# EAGLE design SureDSP Breakout (EAGLE 7.6.0)
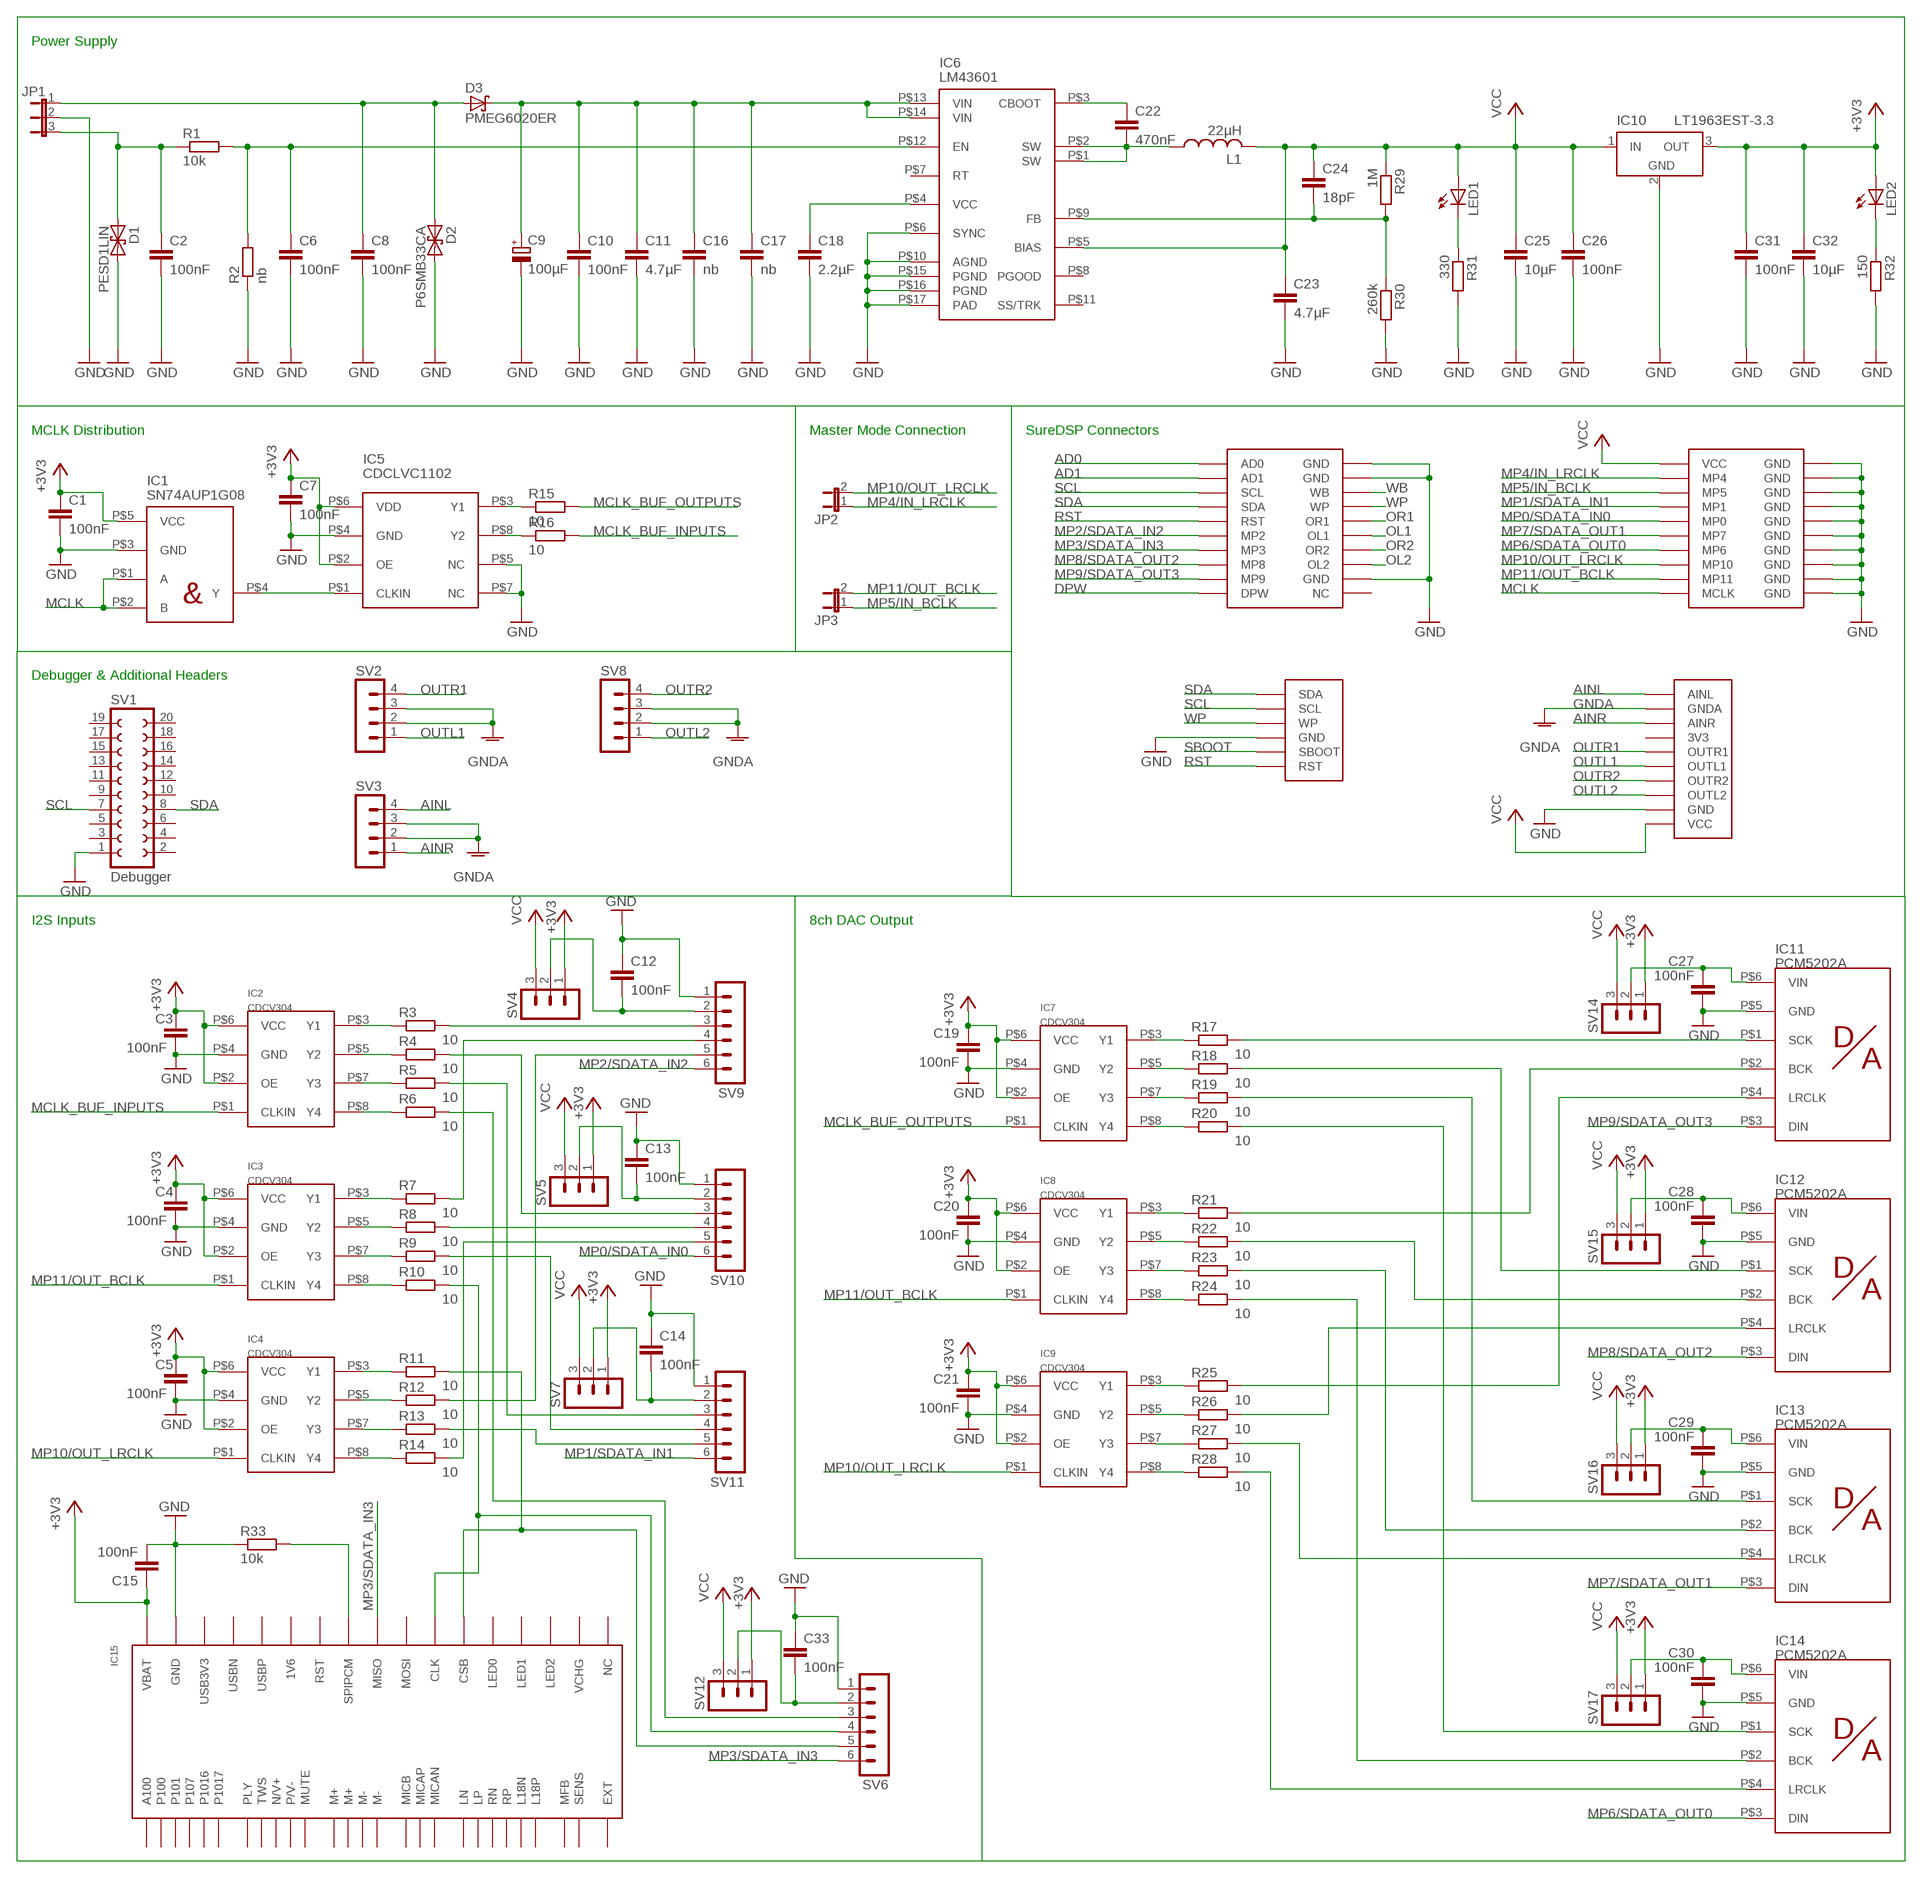
[diagram p0: schematic, sheet 1]

## Parts
C1  100nF  C-EUC0805K  [C0805K]
C2  100nF  C-EUC1210K  [C1210K]
C3  100nF  C-EUC0805K  [C0805K]
C4  100nF  C-EUC0805K  [C0805K]
C5  100nF  C-EUC0805K  [C0805K]
C6  100nF  C-EUC1210K  [C1210K]
C7  100nF  C-EUC0805K  [C0805K]
C8  100nF  C-EUC1210K  [C1210K]
C9  100µF  CPOL-EU150CLZ-0810  [150CLZ-0810]
C10  100nF  C-EUC1210K  [C1210K]
C11  4.7µF  C-EUC1210K  [C1210K]
C12  100nF  C-EUC0805K  [C0805K]
C13  100nF  C-EUC0805K  [C0805K]
C14  100nF  C-EUC0805K  [C0805K]
C15  100nF  C-EUC0805K  [C0805K]
C16  nb  C-EUC1210K  [C1210K]
C17  nb  C-EUC1210K  [C1210K]
C18  2.2µF  C-EUC0805K  [C0805K]
C19  100nF  C-EUC0805K  [C0805K]
C20  100nF  C-EUC0805K  [C0805K]
C21  100nF  C-EUC0805K  [C0805K]
C22  470nF  C-EUC0805K  [C0805K]
C23  4.7µF  C-EUC0805K  [C0805K]
C24  18pF  C-EUC0805K  [C0805K]
C25  10µF  C-EUC1210K  [C1210K]
C26  100nF  C-EUC0805K  [C0805K]
C27  100nF  C-EUC0805K  [C0805K]
C28  100nF  C-EUC0805K  [C0805K]
C29  100nF  C-EUC0805K  [C0805K]
C30  100nF  C-EUC0805K  [C0805K]
C31  100nF  C-EUC0805K  [C0805K]
C32  10µF  C-EUC1210K  [C1210K]
C33  100nF  C-EUC0805K  [C0805K]
D1  PESD1LIN  [PESD1LIN]
D2  P6SMB33CA  [P6SMB]
D3  PMEG6020ER  [PMEG6020ER]
IC1  SN74AUP1G08  [SN74AUP1G08]
IC2  CDCV304  [CDCV304]
IC3  CDCV304  [CDCV304]
IC4  CDCV304  [CDCV304]
IC5  CDCLVC1102  [CDCLVC1102]
IC6  LM43601  [LM43601]
IC7  CDCV304  [CDCV304]
IC8  CDCV304  [CDCV304]
IC9  CDCV304  [CDCV304]
IC10  LT1963EST-3.3  [SOT223]
IC11  PCM5202A  [PCM5202A]
IC12  PCM5202A  [PCM5202A]
IC13  PCM5202A  [PCM5202A]
IC14  PCM5202A  [PCM5202A]
IC15  CSRA64215  [CSRA64215]
IC16  SUREDSP  [SUREDSP]
JP1  JP2E  [JP2]
JP2  JP1E  [JP1]
JP3  JP1E  [JP1]
L1  22µH  L-USL5650M  [L5650M]
LED1  LEDSML0805  [SML0805]
LED2  LEDSML0805  [SML0805]
R1  10k  R-EU_R2012  [R2012]
R2  nb  R-EU_R2012  [R2012]
R3  10  R-EU_R2012  [R2012]
R4  10  R-EU_R2012  [R2012]
R5  10  R-EU_R2012  [R2012]
R6  10  R-EU_R2012  [R2012]
R7  10  R-EU_R2012  [R2012]
R8  10  R-EU_R2012  [R2012]
R9  10  R-EU_R2012  [R2012]
R10  10  R-EU_R2012  [R2012]
R11  10  R-EU_R2012  [R2012]
R12  10  R-EU_R2012  [R2012]
R13  10  R-EU_R2012  [R2012]
R14  10  R-EU_R2012  [R2012]
R15  10  R-EU_R2012  [R2012]
R16  10  R-EU_R2012  [R2012]
R17  10  R-EU_R2012  [R2012]
R18  10  R-EU_R2012  [R2012]
R19  10  R-EU_R2012  [R2012]
R20  10  R-EU_R2012  [R2012]
R21  10  R-EU_R2012  [R2012]
R22  10  R-EU_R2012  [R2012]
R23  10  R-EU_R2012  [R2012]
R24  10  R-EU_R2012  [R2012]
R25  10  R-EU_R2012  [R2012]
R26  10  R-EU_R2012  [R2012]
R27  10  R-EU_R2012  [R2012]
R28  10  R-EU_R2012  [R2012]
R29  1M  R-EU_R2012  [R2012]
R30  260k  R-EU_R2012  [R2012]
R31  330  R-EU_R2012  [R2012]
R32  150  R-EU_R2012  [R2012]
R33  10k  R-EU_R2012  [R2012]
SV1  Debugger  FE10-2  [FE10-2]
SV2  MA04-1  [MA04-1]
SV3  MA04-1  [MA04-1]
SV4  MA03-1  [MA03-1]
SV5  MA03-1  [MA03-1]
SV6  MA06-1  [MA06-1]
SV7  MA03-1  [MA03-1]
SV8  MA04-1  [MA04-1]
SV9  MA06-1  [MA06-1]
SV10  MA06-1  [MA06-1]
SV11  MA06-1  [MA06-1]
SV12  MA03-1  [MA03-1]
SV14  MA03-1  [MA03-1]
SV15  MA03-1  [MA03-1]
SV16  MA03-1  [MA03-1]
SV17  MA03-1  [MA03-1]

## Nets
+3V3: C1.1 C3.1 C4.1 C5.1 C7.1 C15.1 C19.1 C20.1 C21.1 C31.1 C32.1 IC1.P$5(VCC) IC2.P$2(OE) IC2.P$6(VCC) IC3.P$2(OE) IC3.P$6(VCC) IC4.P$2(OE) IC4.P$6(VCC) IC5.P$2(OE) IC5.P$6(VDD) IC7.P$2(OE) IC7.P$6(VCC) IC8.P$2(OE) IC8.P$6(VCC) IC9.P$2(OE) IC9.P$6(VCC) IC10.3(OUT) IC15.P$5(VBAT) LED2.A SV4.1 SV5.1 SV7.1 SV12.1 SV14.1 SV15.1 SV16.1 SV17.1
AD0: IC16.AD0
AD1: IC16.AD1
AINL: IC16.AINL SV3.4
AINR: IC16.AINR SV3.1
DPW: IC16.DPW
GND: C1.2 C2.2 C3.2 C4.2 C5.2 C6.2 C7.2 C8.2 C9.- C10.2 C11.2 C12.1 C13.1 C14.1 C15.2 C16.2 C17.2 C18.2 C19.2 C20.2 C21.2 C23.2 C25.2 C26.2 C27.2 C28.2 C29.2 C30.2 C31.2 C32.2 C33.1 D1.P$2 D2.P$2 IC1.P$3(GND) IC2.P$4(GND) IC3.P$4(GND) IC4.P$4(GND) IC5.P$4(GND) IC5.P$5(NC) IC5.P$7(NC) IC6.P$6(SYNC) IC6.P$10(AGND) IC6.P$15(PGND) IC6.P$16(PGND) IC6.P$17(PAD) IC7.P$4(GND) IC8.P$4(GND) IC9.P$4(GND) IC10.2(GND) IC11.P$5(GND) IC12.P$5(GND) IC13.P$5(GND) IC14.P$5(GND) IC15.P$6(GND) IC16.GND6ER(GND) IC16.GND10ER(GND) IC16.GND20ER1(GND) IC16.GND20ER2(GND) IC16.GND20ER(GND) IC16.P$2(GND) IC16.P$3(GND) IC16.P$6(GND) IC16.P$8(GND) IC16.P$10(GND) IC16.P$12(GND) IC16.P$14(GND) IC16.P$16(GND) IC16.P$18(GND) IC16.P$55(GND) JP1.2 R2.1 R30.2 R31.2 R32.2 R33.1 SV1.1 SV6.1 SV9.1 SV10.1 SV11.1
GNDA: IC16.AGND(GNDA) SV2.2 SV2.3 SV3.2 SV3.3 SV8.2 SV8.3
MCLK: IC1.P$1(A) IC1.P$2(B) IC16.MCLK
MCLK_BUF_INPUTS: IC2.P$1(CLKIN) R16.2
MCLK_BUF_OUTPUTS: IC7.P$1(CLKIN) R15.2
MP0/SDATA_IN0: IC16.MP0 SV10.6
MP1/SDATA_IN1: IC16.MP1 SV11.6
MP2/SDATA_IN2: IC16.MP2 SV9.6
MP3/SDATA_IN3: IC15.P$7(MISO) IC16.MP3 SV6.6
MP4/IN_LRCLK: IC16.MP4 JP2.1
MP5/IN_BCLK: IC16.MP5 JP3.1
MP6/SDATA_OUT0: IC14.P$3(DIN) IC16.MP6
MP7/SDATA_OUT1: IC13.P$3(DIN) IC16.MP7
MP8/SDATA_OUT2: IC12.P$3(DIN) IC16.MP8
MP9/SDATA_OUT3: IC11.P$3(DIN) IC16.MP9
MP10/OUT_LRCLK: IC4.P$1(CLKIN) IC9.P$1(CLKIN) IC16.MP10 JP2.2
MP11/OUT_BCLK: IC3.P$1(CLKIN) IC8.P$1(CLKIN) IC16.MP11 JP3.2
N$6: IC7.P$3(Y1) R17.1
N$7: IC12.P$1(SCK) R18.2
N$8: IC13.P$1(SCK) R19.2
N$9: IC14.P$1(SCK) R20.2
N$10: IC14.P$2(BCK) R24.2
N$11: IC14.P$4(LRCLK) R28.2
N$12: IC13.P$4(LRCLK) R27.2
N$13: IC13.P$2(BCK) R23.2
N$14: IC12.P$4(LRCLK) R26.2
N$15: IC12.P$2(BCK) R22.2
N$16: IC11.P$4(LRCLK) R25.2
N$17: IC11.P$2(BCK) R21.2
N$18: IC7.P$5(Y2) R18.1
N$19: IC7.P$7(Y3) R19.1
N$20: IC7.P$8(Y4) R20.1
N$21: IC8.P$3(Y1) R21.1
N$22: IC8.P$5(Y2) R22.1
N$23: IC8.P$7(Y3) R23.1
N$24: IC8.P$8(Y4) R24.1
N$25: IC9.P$3(Y1) R25.1
N$26: IC9.P$5(Y2) R26.1
N$27: IC9.P$7(Y3) R27.1
N$28: IC9.P$8(Y4) R28.1
N$29: IC11.P$1(SCK) R17.2
N$30: R3.2 SV9.3
N$31: IC1.P$4(Y) IC5.P$1(CLKIN)
N$32: IC5.P$3(Y1) R15.1
N$33: IC5.P$8(Y2) R16.1
N$34: R7.2 SV9.4
N$35: R12.2 SV9.5
N$36: R4.2 SV10.3
N$37: R5.2 SV11.3
N$38: C12.2 SV4.2 SV9.2
N$39: R8.2 SV10.4
N$40: R9.2 SV11.4
N$41: C14.2 SV7.2 SV11.2
N$42: R14.2 SV10.5
N$43: R13.2 SV11.5
N$44: IC2.P$3(Y1) R3.1
N$45: IC2.P$5(Y2) R4.1
N$46: IC2.P$7(Y3) R5.1
N$47: IC2.P$8(Y4) R6.1
N$48: IC3.P$3(Y1) R7.1
N$49: IC3.P$5(Y2) R8.1
N$50: IC3.P$7(Y3) R9.1
N$51: IC3.P$8(Y4) R10.1
N$52: IC4.P$3(Y1) R11.1
N$53: IC4.P$5(Y2) R12.1
N$54: IC4.P$7(Y3) R13.1
N$55: IC4.P$8(Y4) R14.1
N$56: C33.2 SV6.2 SV12.2
N$57: C18.1 IC6.P$4(VCC)
N$58: C9.+ C10.1 C11.1 C16.1 C17.1 D3.P$2(C) IC6.P$13(VIN) IC6.P$14(VIN)
N$59: C22.2 IC6.P$1(SW) IC6.P$2(SW) L1.1
N$60: C22.1 IC6.P$3(CBOOT)
N$61: C2.1 D1.P$1 JP1.3 R1.1
N$62: C8.1 D2.P$1 D3.P$1(A) JP1.1
N$63: C24.2 IC6.P$9(FB) R29.2 R30.1
N$64: C6.1 IC6.P$12(EN) R1.2 R2.2
N$65: C30.1 IC14.P$6(VIN) SV17.2
N$66: C29.1 IC13.P$6(VIN) SV16.2
N$67: C28.1 IC12.P$6(VIN) SV15.2
N$68: C27.1 IC11.P$6(VIN) SV14.2
N$70: C13.2 SV5.2 SV10.2
N$72: IC15.P$11(SPIPCM) R33.2
N$73: LED2.C R32.1
N$74: LED1.C R31.1
N$75: R6.2 SV6.3
N$76: IC15.P$9(CLK) R10.2 SV6.4
N$77: IC15.P$10(CSB) R11.2 SV6.5
OL1: IC16.OL1
OL2: IC16.OL2
OR1: IC16.OR1
OR2: IC16.OR2
OUTL1: IC16.OUTL1 SV2.1
OUTL2: IC16.OUTL2 SV8.1
OUTR1: IC16.OUTR1 SV2.4
OUTR2: IC16.OUTR2 SV8.4
RST: IC16.RESET(RST) IC16.RST
SBOOT: IC16.SBOOT
SCL: IC16.SCL IC16.SCL20ER(SCL) SV1.7
SDA: IC16.SDA IC16.SDA20ER(SDA) SV1.8
VCC: C23.1 C24.1 C25.1 C26.1 IC6.P$5(BIAS) IC10.1(IN) IC16.VIN10ER(VCC) IC16.VIN@2(VCC) L1.2 LED1.A R29.1 SV4.3 SV5.3 SV7.3 SV12.3 SV14.3 SV15.3 SV16.3 SV17.3
WB: IC16.WB
WP: IC16.WP IC16.WP20ER(WP)
Unconnected: IC6.P$7(RT) IC6.P$8(PGOOD) IC6.P$11(SS/TRK) IC15.P$1(VCHG) IC15.P$2(USBN) IC15.P$3(SENS) IC15.P$4(EXT) IC15.P$8(RST) IC15.P$12(MOSI) IC15.P$13(PLY) IC15.P$14(TWS) IC15.P$15(P/V-) IC15.P$16(N/V+) IC15.P$17(MUTE) IC15.P$18(P107) IC15.P$19(M-) IC15.P$20(M+) IC15.P$21(M-) IC15.P$22(M+) IC15.P$23(USBP) IC15.P$24(A100) IC15.P$25(P101) IC15.P$26(P100) IC15.P$27(MFB) IC15.P$28(1V6) IC15.P$29(LED0) IC15.P$30(LED1) IC15.P$31(LED2) IC15.P$32(MICAN) IC15.P$33(MICAP) IC15.P$34(MICB) IC15.P$35(L18N) IC15.P$36(L18P) IC15.P$37(RN) IC15.P$38(RP) IC15.P$39(LN) IC15.P$40(LP) IC15.P$41(P1016) IC15.P$42(P1017) IC15.P$43(NC) IC15.P$44(USB3V3) IC16.3V310ER(3V3) IC16.3V320ER(NC) SV1.2 SV1.3 SV1.4 SV1.5 SV1.6 SV1.9 SV1.10 SV1.11 SV1.12 SV1.13 SV1.14 SV1.15 SV1.16 SV1.17 SV1.18 SV1.19 SV1.20

## Notes on the sheet
- Power Supply
- MCLK Distribution | Master Mode Connection | SureDSP Connectors
- Debugger & Additional Headers
- I2S Inputs | 8ch DAC Output

## Power pins joined to a net without a drawn wire
GND: IC10.4(GND)

## Library data of the parts
C1-C8 C10-C33 = rcl:C-EU: CAPACITOR, European symbol
C9 = rcl:CPOL-EU: POLARIZED CAPACITOR, European symbol
D1 = Eigene Bauteile:PESD1LIN
D2 = Eigene Bauteile:P6SMB33CA
D3 = Eigene Bauteile:PMEG6020ER
IC1 = Eigene Bauteile:SN74AUP1G08: SN74AUP1G08 DCK Gehäuse = SOT353 Alternative Toshiba TC7SZ08FU
IC2-IC4 IC7-IC9 = Eigene Bauteile:CDCV304: CDCV304 1:4 Clock Buffer with TTL Level
IC5 = Eigene Bauteile:CDCLVC1102
IC6 = Eigene Bauteile:LM43601
IC10 = linear-technology:LT1963EST: 1.5A, Low Noise, Fast Transient Response LDO Regulator Source: http://www.linear.com/pc/downloadDocument.do?navId=H0,C3,P2222,D3148; MPN: LT1963EST-3.3; OC_FARNELL: 1501032; OC_NEWARK: 57M7546
IC11-IC14 = Eigene Bauteile:PCM5202A
IC15 = Eigene Bauteile:CSRA64215
IC16 = Eigene Bauteile:SUREDSP
JP1 = jumper:JP2E: JUMPER
JP2 JP3 = jumper:JP1E: JUMPER
L1 = rcl:L-US: INDUCTOR, American symbol
LED1 LED2 = led:LED: LED OSRAM: - CHIPLED LG R971, LG N971, LY N971, LG Q971, LY Q971, LO R971, LY R971 LH N974, LH R974 LS Q976, LO Q976, LY Q976 LO Q996 - Hyper CHIPLED LW Q18S LB Q993, LB Q99A, LB R99A - SideLED LS A670, LO A670, LY A670, LG A670, LP A670 LB A673, LV A673, LT A673, LW A673 LH A674 LY A675 LS A676, LA A676, LO A676, LY A676, LW A676 LS A679, LY A679, LG A679 - Hyper Micro SIDELED® LS Y876, LA Y876, LO Y876, LY Y876 LT Y87S - SmartLED LW L88C, LW L88S LB L89C, LB L89S, LG L890 LS L89K, LO L89K, LY L89K LS L896, LA L896, LO L896, LY L896 - TOPLED LS T670, LO T670, LY T670, LG T670, LP T670 LSG T670, LSP T670, LSY T670, LOP T670, LYG T670 LG T671, LOG T671, LSG T671 LB T673, LV T673, LT T673, LW T673 LH T674 LS T676, LA T676, LO T676, LY T676, LB T676, LH T676, LSB T676, LW T676 LB T67C, LV T67C, LT T67C, LS T67K, LO T67K, LY T67K, LW E67C LS E67B, LA E67B, LO E67B, LY E67B, LB E67C, LV E67C, LT E67C LW T67C LS T679, LY T679, LG T679 LS T770, LO T770, LY T770, LG T770, LP T770 LB T773, LV T773, LT T773, LW T773 LH T774 LS E675, LA E675, LY E675, LS T675 LS T776, LA T776, LO T776, LY T776, LB T776 LHGB T686 LT T68C, LB T68C - Hyper Mini TOPLED® LB M676 - Mini TOPLED Santana® LG M470 LS M47K, LO M47K, LY M47K Source: http://www.osram.convergy.de LUXEON: - LUMILED® LXK2-PW12-R00, LXK2-PW12-S00, LXK2-PW14-U00, LXK2-PW14-V00 LXK2-PM12-R00, LXK2-PM12-S00, LXK2-PM14-U00 LXK2-PE12-Q00, LXK2-PE12-R00, LXK2-PE12-S00, LXK2-PE14-T00, LXK2-PE14-U00 LXK2-PB12-K00, LXK2-PB12-L00, LXK2-PB12-M00, LXK2-PB14-N00, LXK2-PB14-P00, LXK2-PB14-Q00 LXK2-PR12-L00, LXK2-PR12-M00, LXK2-PR14-Q00, LXK2-PR14-R00 LXK2-PD12-Q00, LXK2-PD12-R00, LXK2-PD12-S00 LXK2-PH12-R00, LXK2-PH12-S00 LXK2-PL12-P00, LXK2-PL12-Q00, LXK2-PL12-R00 Source: www.luxeon.com KINGBRIGHT: KA-3528ASYC Source: www.kingbright.com
R1-R33 = rcl:R-EU_: RESISTOR, European symbol
SV1 = con-lsta:FE10-2: FEMALE HEADER; OC_FARNELL: unknown; OC_NEWARK: unknown
SV2 SV3 SV8 = con-lstb:MA04-1: PIN HEADER; OC_FARNELL: unknown; OC_NEWARK: unknown
SV4 SV5 SV7 SV12 SV14-SV17 = con-lstb:MA03-1: PIN HEADER; OC_FARNELL: unknown; OC_NEWARK: unknown
SV6 SV9-SV11 = con-lstb:MA06-1: PIN HEADER; OC_FARNELL: unknown; OC_NEWARK: unknown

## Board
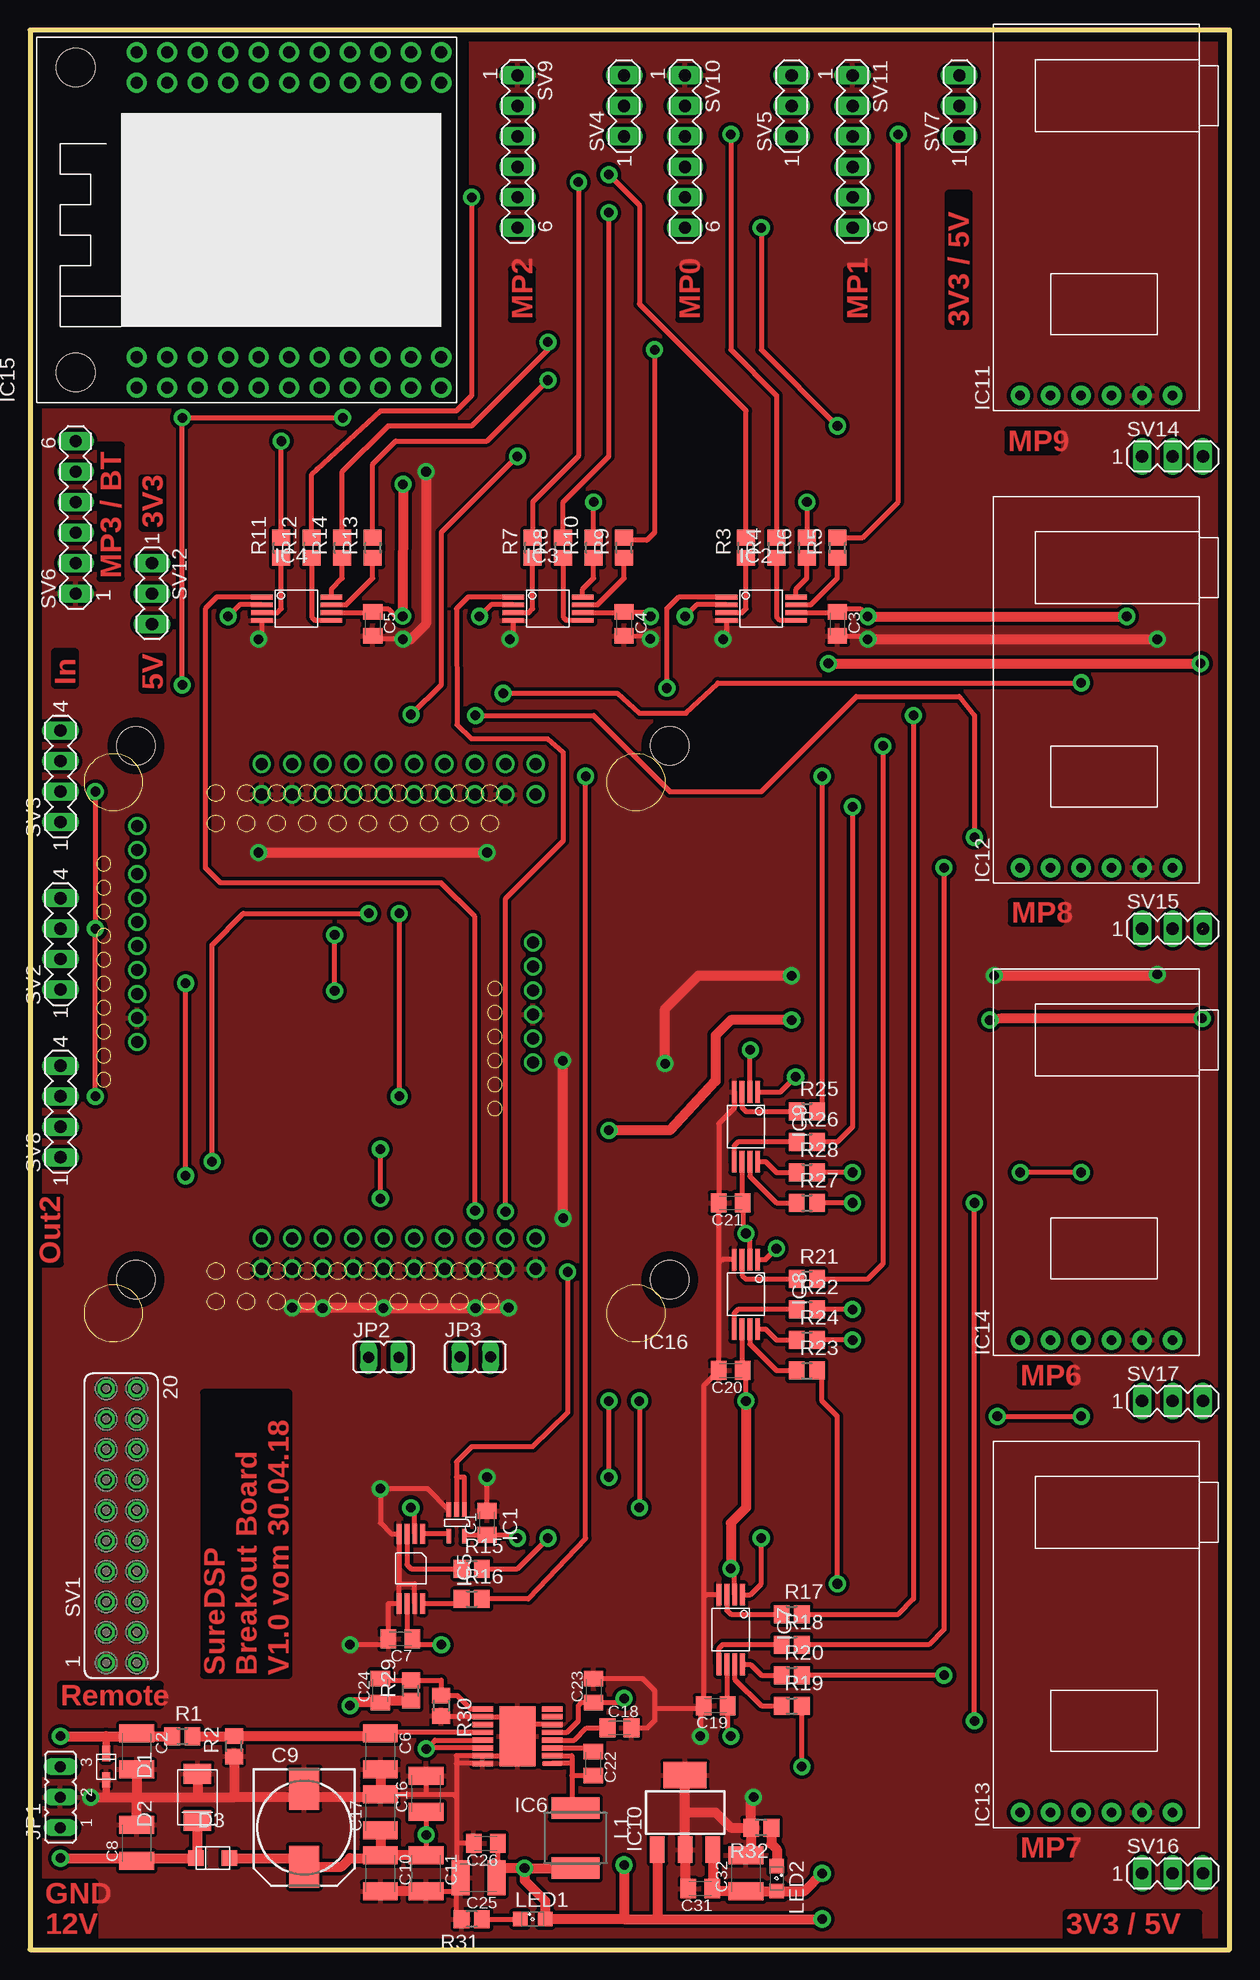
[diagram p1: board, top side]
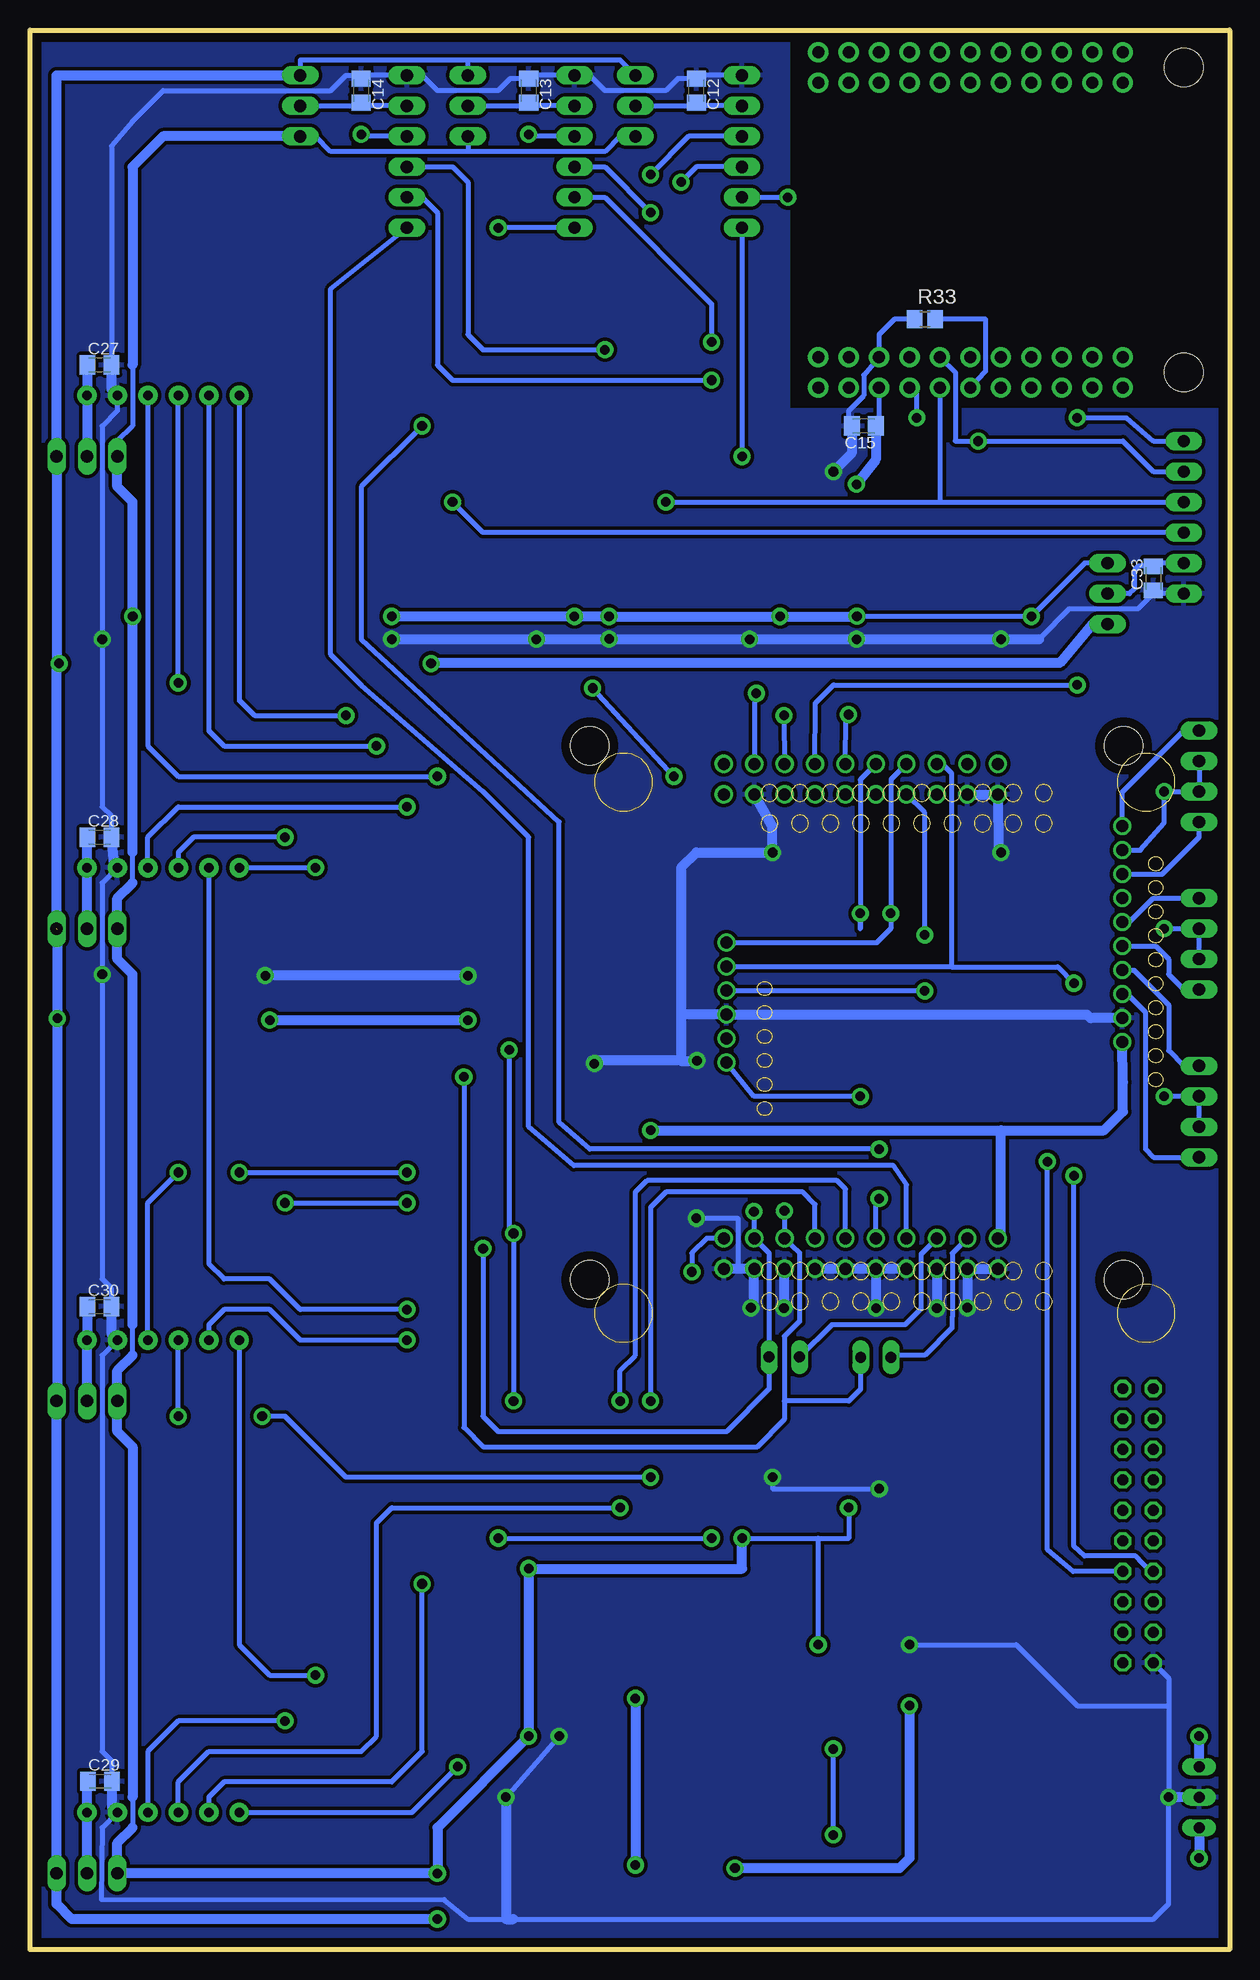
[diagram p2: board, bottom side, seen from below]

Size 100 x 160 mm. Coordinates in mm from the lower left corner, seen from the top.
Outline: 0,0 100,0 100,160 0,160 0,0
Copper layers (1*16): Top 0.035mm / dielectric 1.5mm / Bottom 0.035mm
Design rules "default *": minimum track width 10mil, minimum drill 0.8mm, track to track 0.2mm, track to pad 0.2mm, pad to pad 0.2mm, via to via 0.4mm, smd to smd 0.4mm, copper to edge 30mil, drill to drill 8mil, minimum pad ring 10mil, minimum via ring 8mil, stop-mask expansion 4mil, vias tented up to drill 0mil, thermal gap 10mil

### Footprints (pad centres in the part's own frame; a part is rotated, then mirrored left to right if it is on the bottom)
C0805K = smd 1.3 x 1.6: 1 -1,0; 2 1,0
C1210K = smd 1.5 x 2.9: 1 -1.5,0; 2 1.5,0
150CLZ-0810 = smd 3.5 x 2.5: + 3.25,0; - -3.25,0
PESD1LIN = smd 1.27 x 0.635: P$1 -1.1,0; P$2 1.1,0
P6SMB = smd 1.7 x 2.3: P$1 -1.95,0; P$2 1.95,0
PMEG6020ER = smd 1.3 x 1.3: P$1 -1.4,0; P$2 1.4,0
SN74AUP1G08 = smd 1.2 x 0.4: P$1 -1.1,0.65; P$2 -1.1,0; P$3 -1.1,-0.65; P$4 1.1,-0.65; P$5 1.1,0.65
CDCV304 = smd 1.8 x 0.4: P$1 -2.9,0.975; P$2 -2.9,0.325; P$3 -2.9,-0.325; P$4 -2.9,-0.975; P$5 2.9,-0.975; P$6 2.9,-0.325; P$7 2.9,0.325; P$8 2.9,0.975
CDCLVC1102 = smd 1.7 x 0.4: P$1 -2.9,0.975; P$2 -2.9,0.325; P$3 -2.9,-0.325; P$4 -2.9,-0.975; P$5 2.9,-0.975; P$6 2.9,-0.325; P$7 2.9,0.325; P$8 2.9,0.975
LM43601 = smd 1.7 x 0.45: P$1 -2.9,2.275; P$2 -2.9,1.625; P$3 -2.9,0.975; P$4 -2.9,0.325; P$5 -2.9,-0.325; P$6 -2.9,-0.975; P$7 -2.9,-1.625; P$8 -2.9,-2.275; P$9 2.9,-2.275; P$10 2.9,-1.625; P$11 2.9,-0.975; P$12 2.9,-0.325; P$13 2.9,0.325; P$14 2.9,0.975; P$15 2.9,1.625; P$16 2.9,2.275 | smd 3 x 5: P$17 0,0
SOT223 = smd 1.219 x 2.235: 1 -2.311,-3.099; 2 0,-3.099; 3 2.311,-3.099 | smd 3.6 x 2.2: 4 0,3.099
PCM5202A = drill 0.8 pad 1.6: P$1 0,6.35; P$2 0,3.81; P$3 0,1.27; P$4 0,-1.27; P$5 0,-3.81; P$6 0,-6.35
CSRA64215 = drill 1 pad 1.676: P$1 0,0; P$2 2.54,0; P$3 0,2.54; P$4 2.54,2.54; P$5 0,5.08; P$6 2.54,5.08; P$7 0,7.62; P$8 2.54,7.62; P$9 0,10.16; P$10 2.54,10.16; P$11 0,12.7; P$12 2.54,12.7; P$13 0,15.24; P$14 2.54,15.24; P$15 0,17.78; P$16 2.54,17.78; P$17 0,20.32; P$18 2.54,20.32; P$19 0,22.86; P$20 2.54,22.86; P$21 0,25.4; P$22 2.54,25.4; P$23 25.4,0; P$24 27.94,0; P$25 25.4,2.54; P$26 27.94,2.54; P$27 25.4,5.08; P$28 27.94,5.08; P$29 25.4,7.62; P$30 27.94,7.62; P$31 25.4,10.16; P$32 27.94,10.16; P$33 25.4,12.7; P$34 27.94,12.7; P$35 25.4,15.24; P$36 27.94,15.24; P$37 25.4,17.78; P$38 27.94,17.78; P$39 25.4,20.32; P$40 27.94,20.32; P$41 25.4,22.86; P$42 27.94,22.86; P$43 25.4,25.4; P$44 27.94,25.4 | hole 3.2: 1.27,30.48; 26.67,30.48
SUREDSP = drill 1 pad 1.4: 3V310ER 44.4,12.7; 3V320ER 11.175,4.04; AD0 34.035,1.5; AD1 31.495,1.5; AGND 44.4,8.7; AINL 44.4,6.7; AINR 44.4,10.7; DPW 11.175,1.5; GND6ER 11.4,22.4; GND10ER 44.4,22.7; GND20ER 13.715,4.04; GND20ER1 31.495,4.04; GND20ER2 34.035,4.04; MCLK 11.175,41.04; MP0 23.875,41.04; MP1 26.415,41.04; MP2 21.335,1.5; MP3 18.795,1.5; MP4 31.495,41.04; MP5 28.955,41.04; MP6 18.795,41.04; MP7 21.335,41.04; MP8 16.255,1.5; MP9 13.715,1.5; MP10 16.255,41.04; MP11 13.715,41.04; OL1 21.335,4.04; OL2 16.255,4.04; OR1 23.875,4.04; OR2 18.795,4.04; OUTL1 44.4,16.7; OUTL2 44.4,20.7; OUTR1 44.4,14.7; OUTR2 44.4,18.7; P$2 11.175,43.58; P$3 13.715,43.58; P$6 16.255,43.58; P$8 18.795,43.58; P$10 21.335,43.58; P$12 23.875,43.58; P$14 26.415,43.58; P$16 28.955,43.58; P$18 31.495,43.58; P$55 34.035,43.58; RESET 11.4,26.4; RST 23.875,1.5; SBOOT 11.4,24.4; SCL 11.4,18.4; SCL20ER 28.955,1.5; SDA 11.4,16.4; SDA20ER 26.415,1.5; VIN10ER 44.4,24.7; VIN@2 34.035,41.04; WB 28.955,4.04; WP 11.4,20.4; WP20ER 26.415,4.04 | hole 3.2: 0,44.5; 44.5,44.5; 44.5,0; 0,-0.002
JP2 = drill 0.914 long: 1 -2.54,0; 2 0,0; 3 2.54,0
JP1 = drill 0.914 long: 1 0,-1.27; 2 0,1.27
L5650M = smd 1.8 x 4: 1 -2.5,0; 2 2.5,0
SML0805 = smd 1.2 x 1.2: A 1.05,0; C -1.05,0
R2012 = smd 1.3 x 1.5: 1 -0.85,0; 2 0.85,0
FE10-2 = drill 0.914 octagon: 1 -11.43,1.27; 2 -11.43,-1.27; 3 -8.89,1.27; 4 -8.89,-1.27; 5 -6.35,1.27; 6 -6.35,-1.27; 7 -3.81,1.27; 8 -3.81,-1.27; 9 -1.27,1.27; 10 -1.27,-1.27; 11 1.27,1.27; 12 1.27,-1.27; 13 3.81,1.27; 14 3.81,-1.27; 15 6.35,1.27; 16 6.35,-1.27; 17 8.89,1.27; 18 8.89,-1.27; 19 11.43,1.27; 20 11.43,-1.27
MA04-1 = drill 1.016 long: 1 -3.81,0; 2 -1.27,0; 3 1.27,0; 4 3.81,0
MA03-1 = drill 1.016 long: 1 -2.54,0; 2 0,0; 3 2.54,0
MA06-1 = drill 1.016 long: 1 -6.35,0; 2 -3.81,0; 3 -1.27,0; 4 1.27,0; 5 3.81,0; 6 6.35,0

### Placement (x,y rotation side)
C1  38.1,35.56 90 top
C2  8.89,16.51 270 top
C3  67.31,110.49 270 top
C4  49.53,110.49 270 top
C5  28.57,110.49 270 top
C6  29.21,16.51 270 top
C7  30.88,25.89 180 top
C8  8.89,8.89 90 top
C9  22.86,10.16 270 top
C10  29.21,6.35 270 top
C11  33.02,6.35 270 top
C12  44.45,154.94 270 bottom
C13  58.42,154.94 270 bottom
C14  72.39,154.94 270 bottom
C15  30.48,127 180 bottom
C16  33.02,13 90 top
C17  29.21,11.43 90 top
C18  49.14,18.48 0 top
C19  57.15,20.32 180 top
C20  58.42,48.26 180 top
C21  58.42,62.23 180 top
C22  46.96,15.49 270 top
C23  46.99,21.59 90 top
C24  29.21,21.59 90 top
C25  37.38,5.97 180 top
C26  38,8.85 180 top
C27  94.19,132.08 0 bottom
C28  94.19,92.71 0 bottom
C29  94.16,14.02 0 bottom
C30  94.19,53.58 0 bottom
C31  55.88,5.08 180 top
C32  59.69,6.35 90 top
C33  6.35,114.3 90 bottom
D1  6.35,15.24 270 top
D2  13.97,12.7 90 top
D3  15.24,7.62 0 top
IC1  35.56,35.56 270 top
IC2  60.96,111.76 0 top
IC3  43.18,111.76 0 top
IC4  22.23,111.76 0 top
IC5  31.75,31.75 270 top
IC6  40.64,17.78 180 top
IC7  58.42,26.67 270 top
IC8  59.69,54.61 270 top
IC9  59.69,68.58 270 top
IC10  54.61,11.43 0 top
IC11  88.9,129.54 90 top
IC12  88.9,90.17 90 top
IC13  88.9,11.43 90 top
IC14  88.9,50.8 90 top
IC15  34.29,130.2 90 top
IC16  53.34,100.33 180 top
JP1  2.54,12.7 90 top
JP2  29.48,49.36 270 top
JP3  37.11,49.38 270 top
L1  45.48,9.28 270 top
LED1  41.91,2.54 0 top
LED2  62.25,5.91 270 top
R1  12.7,17.78 0 top
R2  17.01,16.95 90 top
R3  59.69,116.84 90 top
R4  62.23,116.84 90 top
R5  67.31,116.84 90 top
R6  64.77,116.84 90 top
R7  41.91,116.84 90 top
R8  44.45,116.84 90 top
R9  49.53,116.84 90 top
R10  46.99,116.84 90 top
R11  20.95,116.84 90 top
R12  23.5,116.84 90 top
R13  28.57,116.84 90 top
R14  26.04,116.84 90 top
R15  36.83,31.75 0 top
R16  36.83,29.21 0 top
R17  63.5,27.94 0 top
R18  63.5,25.4 0 top
R19  63.5,20.32 0 top
R20  63.5,22.86 0 top
R21  64.77,55.88 0 top
R22  64.77,53.34 0 top
R23  64.77,48.26 0 top
R24  64.77,50.8 0 top
R25  64.77,69.85 0 top
R26  64.77,67.31 0 top
R27  64.77,62.23 0 top
R28  64.77,64.77 0 top
R29  31.75,21.59 90 top
R30  34.29,20.32 270 top
R31  36.83,2.54 180 top
R32  60.96,10.16 180 top
R33  25.4,135.89 0 bottom
SV1  7.62,35.32 90 top
SV2  2.54,83.82 90 top
SV3  2.54,97.79 90 top
SV4  49.53,153.67 90 top
SV5  63.5,153.67 90 top
SV6  3.81,119.38 90 top
SV7  77.47,153.67 90 top
SV8  2.54,69.85 90 top
SV9  40.64,149.86 270 top
SV10  54.61,149.86 270 top
SV11  68.58,149.86 270 top
SV12  10.16,113.03 270 top
SV14  95.25,124.46 0 top
SV15  95.25,85.09 0 top
SV16  95.25,6.35 0 top
SV17  95.25,45.72 0 top

### Tracks (layer width: path | path; a pad name or v marks a point on that pad's centre or on a via)
+3V3  (via drill 0.8 pad 1.42)
  Top 0.406: IC1.P$5 36.21,34.56 C1.1 40.37,34.56 v40.64,34.29 | IC5.P$6 31.43,25.89 C7.1 | IC7.P$6 58.09,20.38 C19.1 58.15,18.05 v58.42,17.78 | IC8.P$6 59.37,48.31 C20.1 59.69,47.99 v59.69,45.72 | IC9.P$6 59.37,62.28 C21.1 59.42,59.96 v59.69,59.69 60.02,59.37 IC8.P$2 | IC2.P$6 67.25,111.44 C3.1 67.58,111.76 69.22,111.76 v69.85,111.12 | IC3.P$6 49.48,111.44 C4.1 51.8,111.49 v51.73,111.12 | IC4.P$6 28.52,111.44 C5.1 28.84,111.76 29.84,111.76 30.48,111.12 30.5,111.14 v31.06,111.14 | IC7.P$2 58.74,31.43 v58.42,31.75 | IC4.P$2 17.47,112.08 v16.51,111.12 | IC3.P$2 38.42,112.08 v37.47,111.12 | IC2.P$2 55.57,112.08 v54.61,111.12 | IC9.P$2 60.02,74.61 v60.05,74.99 | IC5.P$2 32.08,36.51 v31.75,36.83 | 31.75,25.77 C7.1 | v34.29,25.4 32.37,25.4 C7.1
  Top 0.813: IC10.3 56.92,5.12 C31.1 57.11,4.85 C32.1 61.78,4.85 LED2.A 64.55,4.86 v66.04,6.35 | v69.85,111.12 v91.44,111.12 | v31.1,122.14 v31.06,111.14 | v59.69,45.72 59.69,36.83 58.42,35.56 v58.42,31.75
  Bottom 0.406: v59.69,45.72 v59.69,59.69 60.05,60.05 v60.05,74.99 | 91.44,12.7 91.44,10.16 | 91.44,49.53 91.44,52.07 | 91.44,88.9 91.44,91.44 | IC15.P$5 29.21,127.27 C15.1 | SV4.1 50.8,151.13 52.07,149.86 63.5,149.86 | SV5.1 63.5,149.86 | 90.17,149.86 91.44,148.59 | 91.44,132.08 91.44,127 92.71,125.73 SV14.1 | 31.11,111.12 v16.51,111.12 12.06,115.57 SV12.1 | v31.75,36.83 31.75,34.29 34.29,34.29 | v40.64,34.29 34.29,34.29 | v34.29,25.4 34.29,34.29 | 63.5,149.86 74.93,149.86 76.2,151.13 SV7.1
  Bottom 0.813: SV14.1 92.71,121.92 91.44,120.65 v91.44,111.12 91.44,91.44 | 91.44,12.7 91.44,41.91 92.71,43.18 SV17.1 92.71,48.26 91.44,49.53 | 91.44,52.07 91.44,81.28 92.71,82.55 SV15.1 92.71,87.63 91.44,88.9 | 91.44,10.16 92.71,8.89 SV16.1 v66.04,6.35 66.04,10.16 v58.42,17.78 v58.42,31.75 40.64,31.75 v40.64,34.29 | v31.06,111.14 31.11,111.12 v37.47,111.12 v51.73,111.12 v54.61,111.12 v69.85,111.12 | C15.1 29.48,124.19 v31.1,122.14 | SV7.1 88.9,151.13 91.44,148.59 91.44,132.08
AINL
  Bottom 0.406: IC16.AINL 8.94,96.47 3.81,101.6 SV3.4
AINR
  Bottom 0.406: IC16.AINR 5.62,89.63 2.54,92.71 SV3.1
GND  (via drill 0.8 pad 1.42)
  Top 0.406: IC5.P$7 32.08,30.48 30.77,30.48 | 30.77,30.48 IC5.P$5 29.88,28.85 C7.2 29.88,25.4 v26.67,25.4 | 30.77,30.48 IC5.P$4 30.12,34.65 29.21,35.56 v29.21,38.4 33.17,38.4 IC1.P$3 | IC9.P$4 58.72,70.14 57.42,68.85 C21.2 57.42,57.15 | 35.56,12.7 35.33,12.93 33.02,12.93 | 35.56,12.7 35.57,8.85 | 35.57,8.85 35.56,6.29 | 35.56,6.29 C25.2 35.88,5.08 35.56,5.08 35.56,4.85 C11.2 | C26.2 35.57,8.85 | 35.56,15.51 35.56,16.16 IC6.P$15 39.37,16.16 39.37,16.51 40.64,16.51 IC6.P$17 | 35.56,15.51 35.56,12.7 | IC6.P$16 35.56,15.51 | R30.2 34.29,19.41 IC6.P$10 39.37,19.41 39.37,19.05 40.64,19.05 IC6.P$17 | IC6.P$6 41.91,18.75 | 41.91,18.75 41.91,19.05 | 41.91,18.75 40.64,18.75 IC6.P$17 | C17.2 33.02,12.93 | C16.2 33.02,12.93 | C9.- 22.86,12.7 | 35.56,6.29 35.56,2.96 R31.2 | C23.2 51.07,22.59 52.07,21.59 52.07,20.05 | 52.07,20.05 52.07,19.05 51.5,18.48 C18.2 | C3.2 69.58,109.49 v69.85,109.22 | C4.2 52.08,109.5 v51.72,109.23 | IC2.P$4 58.06,109.5 v57.78,109.22 | IC3.P$4 40.28,109.5 v40.01,109.22 | IC4.P$4 19.32,109.5 v19.05,109.22 | 57.42,57.15 C20.2 56.15,46.99 56.15,29.21 | IC8.P$4 57.78,57.51 arc90 57.42,57.15 | C1.2 v38.1,39.37 | 55.88,20.05 C19.2 56.15,29.21 | 55.88,20.05 v55.88,17.78 | 55.88,20.05 52.07,20.05 | IC7.P$4 56.51,29.57 arc90 56.15,29.21 | v31.09,109.22 28.84,109.22 C5.2
  Top 0.61: D1.P$2 6.35,12.7
  Top 0.813: v5.08,12.7 6.35,12.7 8.89,12.7 | C8.2 8.89,12.7 | C2.2 8.89,12.7 | 8.89,12.7 13.97,12.7 | 13.97,12.7 17,12.7 | D2.P$2 13.97,12.7 | R2.1 17,12.7 | 17,12.7 22.86,12.7 29.21,12.7 C17.2 C6.2 | C11.2 C10.2 | C31.2 54.61,5.35 IC10.2 54.61,11.43 | R32.2 60.11,8.27 C32.2 | 54.61,11.43 IC10.4 | 54.61,11.43 57.15,11.43 58.42,10.16 R32.2 | v69.85,109.22 v93.98,109.22 | v33.02,123.19 33.02,110.49 31.75,109.22 v31.09,109.22 | R32.2 60.11,12.7 v60.33,12.7 | v63.49,81.17 63.48,81.18 55.72,81.18 52.94,78.4 v52.94,73.84 | v80.38,81.18 93.88,81.18 v93.98,81.28 | v19.05,91.44 v38.1,91.44 | v44.45,60.96 44.45,74.05 v44.4,74.1 | v39.89,53.49 v37.14,53.47 v29.47,53.47 v24.41,53.47 v24.4,53.46 21.89,53.46 v21.86,53.49
  Bottom 0.406: IC11.P$5 92.71,128.27 93.98,127 v93.98,109.22 93.98,95.25 93.19,94.46 C28.2 | IC12.P$5 93.98,88.9 v93.98,81.28 93.98,55.88 93.19,55.09 C30.2 | IC14.P$5 93.98,49.53 93.98,16.51 93.16,15.69 C29.2 | IC13.P$5 93.98,10.16 94.05,4.18 65.46,4.16 63.5,2.54 60.33,2.54 | 59.69,2.54 6.35,2.54 5.08,3.81 v5.08,12.7 5.08,20.32 | R33.1 27.94,135.89 29.21,134.62 IC15.P$6 30.48,131.25 30.48,129.54 31.75,128.27 31.75,127.27 | C27.2 93.19,150.34 91.44,152.4 88.9,154.94 74.93,154.94 73.66,156.21 72.66,156.21 C14.1 72.12,156.21 SV11.1 67.31,156.21 66.04,154.94 60.96,154.94 59.96,155.94 C13.1 58.15,156.21 SV10.1 53.34,156.21 52.07,154.94 46.99,154.94 45.99,155.94 C12.1 44.18,156.21 SV9.1 | v38.1,39.37 38.1,38.4 v29.21,38.4 | C15.2 31.75,127.27 | 31.75,127.27 31.75,127 | SV1.1 5.08,22.62 5.08,20.32 | v55.88,17.78 v60.33,12.7 | 5.08,20.32 12.7,20.32 17.78,25.4 v26.67,25.4 | SV6.1 6.08,113.03 C33.1 6.35,113.03 7.62,111.76 13.34,111.76 15.88,109.22 | v44.45,60.96 40.99,60.96 40.99,56.75
  Bottom 0.813: JP1.2 v5.08,12.7 | IC13.P$5 93.16,11.88 C29.2 | IC14.P$5 93.19,51.28 C30.2 | IC12.P$5 92.98,90.44 C28.2 | IC11.P$5 93.19,130.02 C27.2 | v69.85,109.22 v57.78,109.22 v51.72,109.23 v40.01,109.22 v31.09,109.22 v19.05,109.22 15.88,109.22 | C15.2 31.48,124.73 v33.02,123.19 | v60.33,12.7 60.33,2.54 59.69,2.54 | v63.49,81.17 80.37,81.17 v80.38,81.18 | IC16.GND20ER1 IC16.GND20ER2 19.29,91.61 v19.05,91.44 | 53.2,74.1 v52.94,73.84 52.69,74.1 45.72,74.1 | IC16.P$14 IC16.P$12 | IC16.P$12 IC16.P$10 IC16.P$8 | 45.72,77.93 45.72,90.17 44.45,91.44 v38.1,91.44 38.1,93.61 IC16.GND20ER | 45.72,77.93 45.72,74.1 | 45.72,74.1 45.67,74.05 44.45,74.05 v44.4,74.1 | 9.14,77.43 IC16.GND10ER 11.59,77.63 11.89,77.93 IC16.GND6ER 45.72,77.93 | IC16.P$55 IC16.P$18 21.86,56.74 v21.86,53.49 | IC16.P$16 24.4,56.74 v24.4,53.46 | IC16.P$12 v29.47,53.47 | IC16.P$6 37.14,56.75 v37.14,53.47 | 39.67,56.75 40.99,56.75 IC16.P$2 | IC16.P$3 39.67,56.75 | 39.67,56.75 39.67,53.72 v39.89,53.49
  pour Bottom (isolate 0.3): 0,128.27 36.83,128.27 36.83,160.02 100.33,160.02 100.33,0 0,0
  pour Top (isolate 0.3): 0,128.27 36.83,128.27 36.83,160.02 100.33,160.02 100.33,120.65 100.33,0 0,0 0,110.49
GNDA  (via drill 0.8 pad 1.42)
  Top 0.406: v5.45,96.52 v5.45,85.09 v5.45,71.12
  Bottom 0.406: SV8.2 SV8.3 v5.45,71.12 | SV2.2 SV2.3 v5.45,85.09 | SV3.3 SV3.2 v5.45,96.52 5.45,93.91 7.43,91.63 IC16.AGND
MCLK  (via drill 0.8 pad 1.42)
  Top 0.406: 35.56,39.37 IC1.P$2 | IC1.P$1 36.21,39.37 35.56,39.37 | v44.82,56.48 44.82,44.75 41.91,41.91 36.83,41.91 35.56,40.64 35.56,39.37
  Bottom 0.406: IC16.MCLK 43.58,59.29 44.82,58.05 v44.82,56.48
MCLK_BUF_INPUTS  (via drill 0.8 pad 1.42)
  Top 0.406: IC2.P$1 54.06,112.73 53.85,112.52 | 53.85,112.52 53.1,111.77 | R16.2 41.54,29.21 46.32,34.29 v46.32,97.79 | v53.09,105.14 53.09,111.75 53.85,112.52
  Bottom 0.406: 52.7,104.78 v53.09,105.14 v46.32,97.79
MCLK_BUF_OUTPUTS  (via drill 0.8 pad 1.42)
  Top 0.406: IC7.P$1 60.05,29.57 60.96,30.48 v60.96,34.29 | R15.2 40.64,31.75 v43.18,34.29
  Bottom 0.406: v60.96,34.29 v43.18,34.29
MP0/SDATA_IN0  (via drill 0.8 pad 1.42)
  Top 0.406: v29.21,62.6 v29.21,66.71 | v60.96,143.51 60.96,133.35 v67.31,127
  Bottom 0.406: SV10.6 v60.96,143.51 | v67.31,127 72.39,121.92 72.39,109.22 55.88,93.98 55.88,68.95 53.34,66.71 v29.21,66.71 | IC16.MP0 29.46,62.35 v29.21,62.6
MP1/SDATA_IN1
  Bottom 0.406: SV11.6 74.93,138.43 74.93,107.95 72.39,105.41 62.23,96.52 58.42,92.71 58.42,68.58 54.69,65.34 28.02,65.34 26.92,63.75 IC16.MP1
MP2/SDATA_IN2  (via drill 0.8 pad 1.42)
  Top 0.406: v40.64,124.46 34.29,118.11 34.29,105.41 v31.76,102.93
  Bottom 0.406: SV9.6 v40.64,124.46 | IC16.MP2 32,102.81 v31.76,102.93
MP3/SDATA_IN3  (via drill 0.8 pad 1.42)
  Top 0.406: v12.7,105.41 v12.7,127.67 v26.07,127.67
  Bottom 0.406: v12.7,127.67 8.59,127.67 6.35,125.73 SV6.6 | v12.7,105.41 33.02,105.41 34.54,103.89 IC16.MP3 | v26.07,127.67 26.07,129.68 IC15.P$7
MP4/IN_LRCLK
  Bottom 0.406: JP2.1 28.04,49.53 25.4,49.53 23.12,51.8 23.12,52.71 23.11,52.72 23.11,58.02 IC16.MP4
MP5/IN_BCLK
  Bottom 0.406: IC16.MP5 25.72,57.95 25.72,53.4 27.05,52.07 33.16,52.07 JP3.1
MP6/SDATA_OUT0  (via drill 0.8 pad 1.42)
  Top 0.406: v80.64,44.45 v87.63,44.45 | v48.26,39.37 v48.26,45.72
  Bottom 0.406: v48.26,45.72 48.26,61.86 46.99,63.13 35.56,63.13 34.54,62.11 IC16.MP6 | v87.63,44.45 IC14.P$3 | v48.26,39.37 73.66,39.37 78.74,44.45 v80.64,44.45
MP7/SDATA_OUT1  (via drill 0.8 pad 1.42)
  Top 0.406: v50.8,45.72 v50.8,36.83
  Bottom 0.406: IC13.P$3 87.63,13.97 85.09,16.51 72.39,16.51 71.12,17.78 71.12,35.56 69.85,36.83 v50.8,36.83 | IC16.MP7 32,63.38 32.72,64.1 48.56,64.1 49.53,63.13 49.53,49.53 50.8,48.26 v50.8,45.72
MP8/SDATA_OUT2  (via drill 0.8 pad 1.42)
  Top 0.406: v78.74,92.71 78.74,102.87 77.46,104.45 68.89,104.45 60.96,96.52 53.34,96.52 46.99,102.87 v37.13,102.87
  Bottom 0.406: v78.74,92.71 86.36,92.71 87.63,91.44 IC12.P$3 | IC16.MP8 37.08,100.08 v37.13,102.87
MP9/SDATA_OUT3  (via drill 0.8 pad 1.42)
  Top 0.406: v87.63,105.58 57.32,105.58 57.32,105.49 54.7,103.04 50.8,103.04 48.96,104.71 v39.45,104.71
  Bottom 0.406: v87.63,105.58 IC11.P$3 | v39.45,104.71 39.62,104.71 IC16.MP9
MP10/OUT_LRCLK  (via drill 0.8 pad 1.42)
  Top 0.406: IC4.P$1 15.58,112.73 14.61,111.76 14.61,90.17 15.88,88.9 34.29,88.9 37.1,86.09 v37.1,61.58 | IC9.P$1 62.57,71.48 v63.83,72.74
  Bottom 0.406: 37.11,45.72 37.11,51.1 35.84,52.34 35.84,58.08 IC16.MP10 37.1,59.31 v37.1,61.58 | 37.11,45.72 37.11,44.17 39.37,41.91 62.23,41.91 63.83,43.51 v63.83,72.74 | JP2.2 30.75,46.72 31.75,45.72 37.11,45.72
MP11/OUT_BCLK  (via drill 0.8 pad 1.42)
  Top 0.406: IC8.P$1 61.32,57.51 v62.23,58.42 | IC3.P$1 36.53,112.73 35.56,111.76 35.6,102.09 36.81,100.93 43.16,100.93 44.45,99.81 44.45,92.41 39.65,87.61 v39.65,61.51
  Bottom 0.406: v62.23,58.42 62.23,44.45 60.96,43.18 41.91,43.18 38.38,46.71 JP3.2 38.38,58.05 IC16.MP11 39.65,59.31 v39.65,61.51
N$6
  Top 0.406: IC7.P$3 58.09,28.27 58.42,27.94 R17.1
N$7  (via drill 0.8 pad 1.42)
  Top 0.406: v76.2,90.17 76.2,26.67 74.93,25.4 R18.2
  Bottom 0.406: IC12.P$1 v76.2,90.17
N$8  (via drill 0.8 pad 1.42)
  Top 0.406: v64.35,15.24 R19.2
  Bottom 0.406: IC13.P$1 68.16,11.43 v64.35,15.24
N$9  (via drill 0.8 pad 1.42)
  Top 0.406: v76.2,22.86 R20.2
  Bottom 0.406: IC14.P$1 82.55,25.4 80.01,22.86 v76.2,22.86
N$10  (via drill 0.8 pad 1.42)
  Top 0.406: v68.58,50.8 R24.2
  Bottom 0.406: v68.58,50.8 77.47,50.8 80.01,53.34 83.82,53.34 85.09,52.07 IC14.P$2
N$11  (via drill 0.8 pad 1.42)
  Top 0.406: v87.63,64.77 v82.55,64.77 | v68.58,64.77 R28.2
  Bottom 0.406: IC14.P$4 90.17,62.23 v87.63,64.77 | v82.55,64.77 v68.58,64.77
N$12  (via drill 0.8 pad 1.42)
  Top 0.406: v78.74,19.05 v78.74,62.23 | v68.58,62.23 R27.2
  Bottom 0.406: v78.74,62.23 v68.58,62.23 | v78.74,19.05 87.63,19.05 90.17,16.51 IC13.P$4
N$13  (via drill 0.8 pad 1.42)
  Top 0.406: v67.31,30.48 67.31,44.45 66.04,45.72 66.04,47.84 R23.2
  Bottom 0.406: v67.31,30.48 67.31,16.51 69.85,13.97 83.82,13.97 85.09,12.7 IC13.P$2
N$14  (via drill 0.8 pad 1.42)
  Top 0.406: v68.58,95.25 68.58,68.58 67.31,67.31 R26.2
  Bottom 0.406: v68.58,95.25 87.63,95.25 90.17,92.71 IC12.P$4
N$15  (via drill 0.8 pad 1.42)
  Top 0.406: v68.58,53.34 R22.2
  Bottom 0.406: IC12.P$2 85.09,57.15 83.82,55.88 80.01,55.88 77.47,53.34 v68.58,53.34
N$16  (via drill 0.8 pad 1.42)
  Top 0.406: v66.04,97.79 66.04,70.27 R25.2
  Bottom 0.406: v66.04,97.79 87.63,97.79 90.17,100.33 IC11.P$4
N$17  (via drill 0.8 pad 1.42)
  Top 0.406: v71.12,100.33 71.12,57.15 69.85,55.88 R21.2
  Bottom 0.406: IC11.P$2 85.09,101.6 83.82,100.33 v71.12,100.33
N$18
  Top 0.406: IC7.P$5 57.45,25.11 57.74,25.4 R18.1
N$19
  Top 0.406: IC7.P$7 58.74,22.54 60.96,20.32 R19.1
N$20
  Top 0.406: IC7.P$8 60.05,23.77 60.96,22.86 R20.1
N$21
  Top 0.406: IC8.P$3 59.37,56.2 59.69,55.88 R21.1
N$22
  Top 0.406: IC8.P$5 58.72,53.05 59.01,53.34 R22.1
N$23
  Top 0.406: IC8.P$7 60.02,50.48 62.23,48.26 R23.1
N$24
  Top 0.406: IC8.P$8 61.32,51.71 62.23,50.8 R24.1
N$25
  Top 0.406: IC9.P$3 59.37,70.17 59.69,69.85 R25.1
N$26
  Top 0.406: IC9.P$5 58.72,67.02 59.01,67.31 R26.1
N$27
  Top 0.406: IC9.P$7 60.02,64.44 62.23,62.23 R27.1
N$28
  Top 0.406: IC9.P$8 61.32,65.68 62.23,64.77 R28.1
N$29  (via drill 0.8 pad 1.42)
  Top 0.406: v73.66,102.87 73.66,29.21 72.39,27.94 R17.2
  Bottom 0.406: IC11.P$1 82.55,104.14 81.28,102.87 v73.66,102.87
N$30  (via drill 0.8 pad 1.42)
  Top 0.406: v48.26,147.96 50.8,145.41 50.8,137.16 59.69,128.27 R3.2
  Bottom 0.406: SV9.3 45.09,151.13 v48.26,147.96
N$31
  Top 0.406: IC1.P$4 34.91,34.65 IC5.P$1
N$32
  Top 0.406: IC5.P$3 31.43,32.08 31.75,31.75 R15.1
N$33
  Top 0.406: IC5.P$8 35.62,28.85 R16.1
N$34  (via drill 0.8 pad 1.42)
  Top 0.406: v45.72,147.32 45.72,124.46 41.91,120.65 R7.2
  Bottom 0.406: SV9.4 44.45,148.59 v45.72,147.32
N$35  (via drill 0.8 pad 1.42)
  Top 0.406: v36.83,146.05 36.83,129.54 35.56,128.27 29.21,128.27 23.93,123.4 23.5,122.96 R12.2
  Bottom 0.406: SV9.5 v36.83,146.05
N$36  (via drill 0.8 pad 1.42)
  Top 0.406: v58.42,151.3 58.42,133.35 62.23,129.54 R4.2
  Bottom 0.406: SV10.3 58.25,151.13 v58.42,151.3
N$37  (via drill 0.8 pad 1.42)
  Top 0.406: R5.2 69.43,117.69 72.39,120.65 v72.39,151.3
  Bottom 0.406: SV11.3 72.22,151.13 v72.39,151.3
N$38
  Bottom 0.406: SV9.2 44.18,153.67 C12.2 44.72,153.67 SV4.2
N$39  (via drill 0.8 pad 1.42)
  Top 0.406: v48.26,144.78 48.26,124.46 44.45,120.65 R8.2
  Bottom 0.406: SV10.4 52.07,148.59 v48.26,144.78
N$40  (via drill 0.8 pad 1.42)
  Top 0.406: v52.07,133.35 52.07,118.11 51.44,117.47 49.74,117.47 R9.2
  Bottom 0.406: SV11.4 64.77,148.59 63.5,147.32 63.5,134.62 62.23,133.35 v52.07,133.35
N$41
  Bottom 0.406: SV11.2 72.12,153.67 C14.2 72.66,153.67 SV7.2
N$42  (via drill 0.8 pad 1.42)
  Top 0.406: R14.2 26.04,123.19 29.84,127 36.83,127 43.18,133.35 v43.18,133.99
  Bottom 0.406: v43.18,133.99 43.18,137.16 52.07,146.05 SV10.5
N$43  (via drill 0.8 pad 1.42)
  Top 0.406: R13.2 28.57,123.83 30.48,125.73 38.1,125.73 v43.18,130.81
  Bottom 0.406: SV11.5 67.31,146.05 66.04,144.78 66.04,132.08 64.77,130.81 v43.18,130.81
N$44
  Top 0.406: IC2.P$3 59.37,111.44 59.69,111.76 R3.1
N$45
  Top 0.406: R4.1 62.23,111.12 62.52,110.78 IC2.P$5
N$46
  Top 0.406: IC2.P$7 65.09,112.08 67.31,114.3 R5.1
N$47
  Top 0.406: IC2.P$8 63.86,113.39 64.77,114.3 R6.1
N$48
  Top 0.406: IC3.P$3 41.59,111.44 41.91,111.76 R7.1
N$49
  Top 0.406: IC3.P$5 44.74,110.78 44.45,111.08 R8.1
N$50
  Top 0.406: IC3.P$7 47.31,112.08 49.53,114.3 R9.1
N$51
  Top 0.406: IC3.P$8 46.08,113.39 46.99,114.3 R10.1
N$52
  Top 0.406: IC4.P$3 20.63,111.44 20.95,111.76 R11.1
N$53
  Top 0.406: IC4.P$5 23.79,110.78 23.5,111.08 R12.1
N$54
  Top 0.406: IC4.P$7 26.36,112.08 28.57,114.3 R13.1
N$55
  Top 0.406: IC4.P$8 25.12,113.39 26.04,114.3 R14.1
N$56
  Bottom 0.406: SV6.2 6.08,115.57 C33.2 7.61,115.3 7.94,114.97 7.94,113.41 8.33,113.01 10.14,113.01 SV12.2
N$57
  Top 0.406: IC6.P$4 45.4,17.45 46.42,18.48 C18.1
N$58  (via drill 0.8 pad 1.42)
  Top 0.406: C16.1 33.02,11.2 v33.02,9.55 C11.1 arc-90 C11.1 | IC6.P$13 33.76,17.45 v33.02,16.72 arc-90 33.11,16.8 IC6.P$14
  Top 0.813: D3.P$2 22.86,7.62 C9.+ 25.96,6.91 26.67,7.62 28.98,7.62 C10.1 | C11.1 C10.1 | C17.1 C10.1
  Bottom 0.406: v33.02,9.55 v33.02,16.72
N$59
  Top 0.406: IC6.P$2 45.18,16.16 45.18,15.5 | 45.18,15.5 IC6.P$1 | 45.18,15.5 45.18,14.49 | 45.18,14.49 45.18,12.08 L1.1 | C22.2 45.18,14.49
N$60
  Top 0.406: IC6.P$3 46.99,16.8 C22.1
N$61  (via drill 0.8 pad 1.42)
  Top 0.61: D1.P$1 6.35,17.78
  Top 0.813: v2.54,17.78 6.35,17.78 8.89,17.78 | 8.89,17.78 R1.1 | C2.1 8.89,17.78
  Bottom 0.813: JP1.3 v2.54,17.78
N$62  (via drill 0.8 pad 1.42)
  Top 0.813: v2.54,7.62 8.89,7.62 | 8.89,7.62 D3.P$1 13.97,7.62 D2.P$1 | C8.1 8.89,7.62
  Bottom 0.813: JP1.1 v2.54,7.62
N$63
  Top 0.406: IC6.P$9 36.73,20.05 35.62,21.17 R30.1 34.29,22.44 R29.2 29.36,22.44 C24.2
N$64
  Top 0.406: IC6.P$12 29.21,18.11 C6.1
  Top 0.813: R1.2 17,17.78 R2.2 29,17.8 arc90 C6.1
N$65
  Bottom 0.813: SV17.2 IC14.P$6 95.19,50.86 C30.1
N$66
  Bottom 0.813: SV16.2 IC13.P$6 95.25,13.93 C29.1
N$67
  Bottom 0.813: SV15.2 IC12.P$6 95.25,92.71 C28.1
N$68
  Bottom 0.813: SV14.2 IC11.P$6 95.19,129.6 C27.1
N$70
  Bottom 0.406: SV10.2 58.15,153.67 C13.2 58.69,153.67 SV5.2
N$72
  Bottom 0.406: IC15.P$11 20.32,131.55 20.32,135.89 R33.2
N$73
  Top 0.813: R32.1 61.81,8.8 62.26,8.35 62.26,6.97 LED2.C
N$74
  Top 0.406: R31.1 LED1.C
N$75  (via drill 0.8 pad 1.42)
  Top 0.406: v64.77,120.65 R6.2
  Bottom 0.406: SV6.3 62.23,118.11 v64.77,120.65
N$76  (via drill 0.8 pad 1.42)
  Top 0.406: R10.2 v46.99,120.65
  Bottom 0.406: IC15.P$9 24.13,120.65 | 24.13,120.65 SV6.4 | v46.99,120.65 24.13,120.65
N$77  (via drill 0.8 pad 1.42)
  Top 0.406: R11.2 v20.95,125.73
  Bottom 0.406: IC15.P$10 22.86,131.48 22.86,125.73 v20.95,125.73 8.89,125.73 6.35,123.19 SV6.5
OUTL1
  Bottom 0.406: IC16.OUTL1 6.16,83.63 5.08,82.55 5.08,81.28 3.81,80.01 SV2.1
OUTL2
  Bottom 0.406: IC16.OUTL2 8.51,79.63 7.02,78.14 7.02,66.71 6.35,66.04 SV8.1
OUTR1
  Bottom 0.406: IC16.OUTR1 8.35,85.63 6.35,87.63 SV2.4
OUTR2
  Bottom 0.406: IC16.OUTR2 7.97,81.63 5.08,78.74 5.08,74.93 3.81,73.66 SV8.4
RST  (via drill 0.8 pad 1.42)
  Top 0.406: v30.78,86.36 v30.78,71.12
  Bottom 0.406: v30.78,71.12 39.63,71.12 IC16.RESET | IC16.RST 30.79,97.5 30.79,85.1 v30.78,86.36
SCL  (via drill 0.8 pad 1.42)
  Top 0.406: v12.97,64.5 v12.97,80.54
  Bottom 0.406: SV1.7 6.61,31.51 7.83,32.8 12.1,32.8 12.97,33.6 v12.97,64.5 | IC16.SCL20ER 23.94,98.83 23.17,98.06 23.17,82.74 23.19,81.9 | 23.19,81.9 41.15,81.9 IC16.SCL | 23.19,81.9 14.33,81.9 v12.97,80.54
SDA  (via drill 0.8 pad 1.42)
  Top 0.406: v15.17,65.67 15.17,83.75 17.78,86.36 v28.24,86.36
  Bottom 0.406: SV1.8 13.06,31.51 15.17,33.32 v15.17,65.67 | IC16.SDA20ER 28.22,97.54 28.22,86.34 v28.24,86.36 28.24,85.09 29.4,83.93 IC16.SDA
VCC  (via drill 0.8 pad 1.42)  (1 unrouted)
  Top 0.406: C26.1 38.99,6.35 39.37,5.97 C25.1 38.88,6.35 39.37,6.35 39.37,6.78 | 29.21,20.74 C24.1 | IC6.P$5 44.77,18.11 45.72,19.05 45.72,20.32 45.99,20.59 C23.1 49.26,20.59 v49.53,20.92 | 26.67,20.59 v26.67,20.32
  Top 0.813: v41.23,6.78 39.37,6.78 | R29.1 29.21,20.74 | C24.1 26.67,20.59 | v41.23,6.78 L1.2 45.76,7.06 | v41.23,6.78 41.23,5.76 42.96,4.03 LED1.A 49.53,2.54 | IC10.1 52.3,2.77 52.07,2.54 | v49.53,7.04 49.53,2.54 | 49.53,2.54 52.07,2.54 | 52.07,2.54 v66.04,2.54 | v66.56,107.2 v97.58,107.2 | v97.71,77.61 81.05,77.61 v80.01,77.47 | v63.5,77.47 58.42,77.47 57.15,76.2 57.15,72.39 53.34,68.28 v48.26,68.28
  Bottom 0.406: SV4.3 50.8,157.48 63.5,157.48 | 63.5,157.48 77.47,157.48 SV7.3 | SV5.3 63.5,157.48
  Bottom 0.813: v26.67,20.32 26.67,7.62 27.51,6.78 v41.23,6.78 | v49.53,20.92 v49.53,7.04 | v66.04,2.54 96.52,2.54 97.79,3.81 SV16.3 SV17.3 97.71,45.8 v97.71,77.61 97.71,85.01 | SV12.3 11.43,110.49 14.15,107.23 66.53,107.23 v66.56,107.2 | SV15.3 97.79,106.68 97.58,106.89 v97.58,107.2 97.79,107.42 SV14.3 97.79,156.21 SV7.3 | v80.01,77.47 v63.5,77.47 | v48.26,68.28 19.05,68.28 | 19.05,68.28 10.46,68.28 8.89,69.85 8.89,72.3 IC16.VIN10ER | IC16.VIN@2 19.05,59.55 19.05,68.28
WP  (via drill 0.8 pad 1.42)
  Top 0.406: v25.4,79.9 v25.4,84.57
  Bottom 0.406: v25.4,84.57 25.4,94.77 IC16.WP20ER | IC16.WP 25.98,79.93 v25.4,79.9

### Text on the board
Top: MP2 | MP0 | MP1 | 3V3 / 5V | MP9 | 3V3 | MP3 / BT | In | 5V | MP8 | Out2 | MP6 | SureDSP / Breakout Board / V1.0 vom 30.04.18 | Remote | MP7 | GND | 12V | 3V3 / 5V